# EAGLE design Lipmouse_Daughterboard (EAGLE 6.5.0)
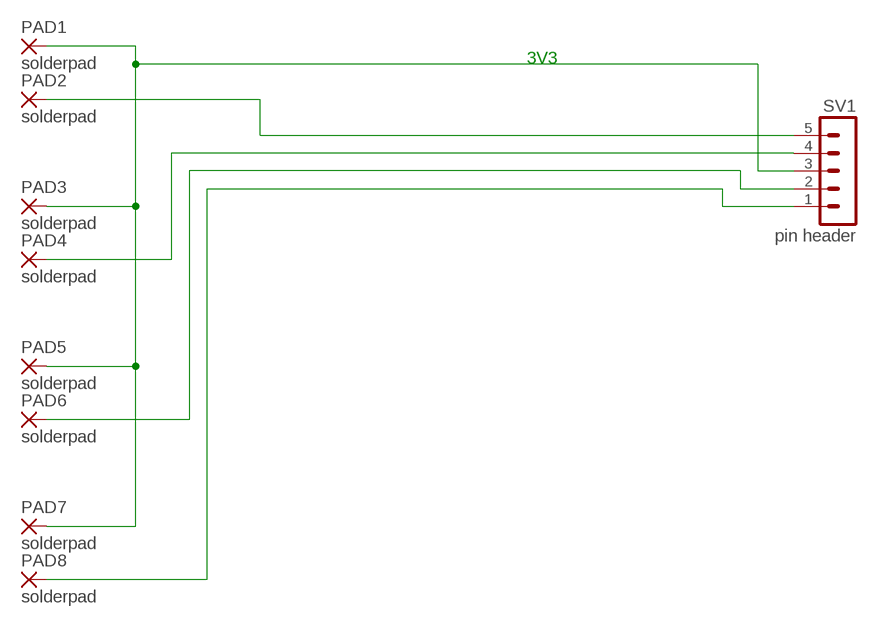
[diagram p0: schematic, sheet 1]

## Parts
PAD1  solderpad  SMD5  [SMD2,54-5,08]
PAD2  solderpad  SMD5  [SMD2,54-5,08]
PAD3  solderpad  SMD5  [SMD2,54-5,08]
PAD4  solderpad  SMD5  [SMD2,54-5,08]
PAD5  solderpad  SMD5  [SMD2,54-5,08]
PAD6  solderpad  SMD5  [SMD2,54-5,08]
PAD7  solderpad  SMD5  [SMD2,54-5,08]
PAD8  solderpad  SMD5  [SMD2,54-5,08]
SV1  pin header  MA05-1  [MA05-1]

## Nets
3V3: PAD1.1(P) PAD3.1(P) PAD5.1(P) PAD7.1(P) SV1.3
N$20: PAD2.1(P) SV1.5
N$21: PAD4.1(P) SV1.4
N$22: PAD6.1(P) SV1.2
N$23: PAD8.1(P) SV1.1

## Notes on the sheet
- 3V3

## Library data of the parts
PAD1-PAD8 = wirepad:SMD5: SMD PAD
SV1 = con-lstb:MA05-1: PIN HEADER; OC_FARNELL: unknown; OC_NEWARK: unknown

## Board
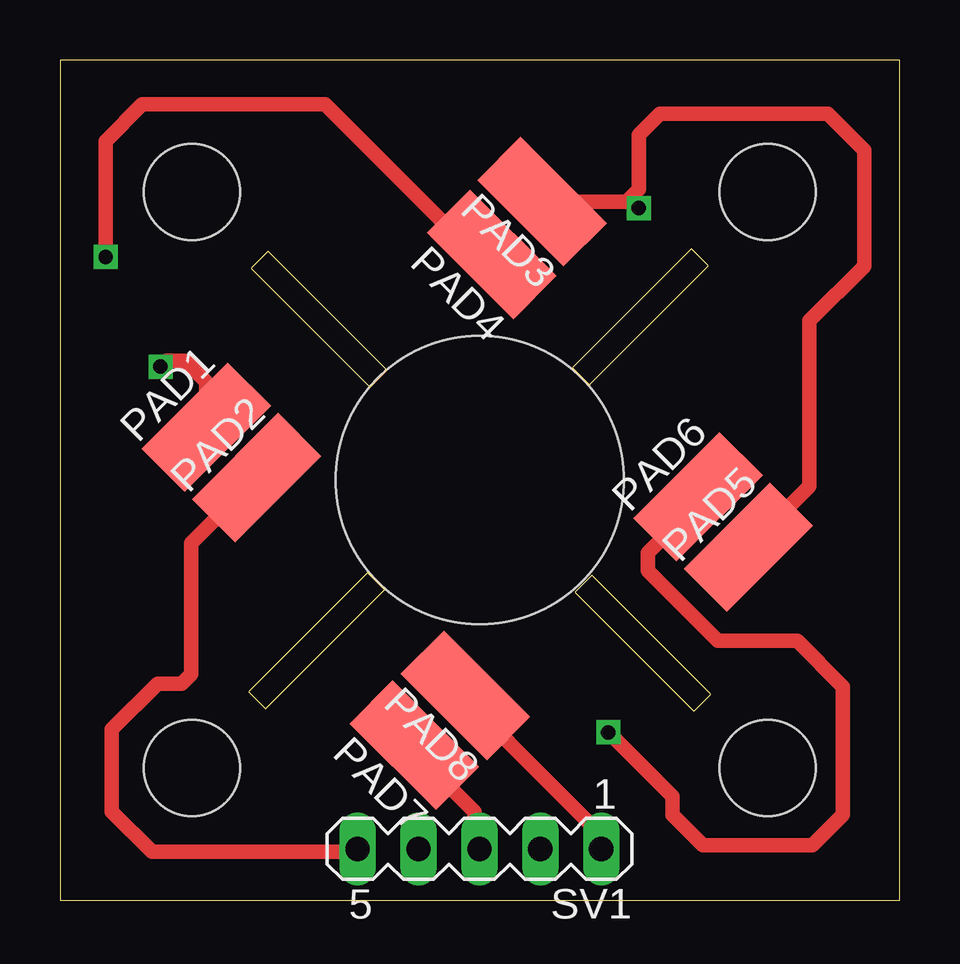
[diagram p1: board, top side]
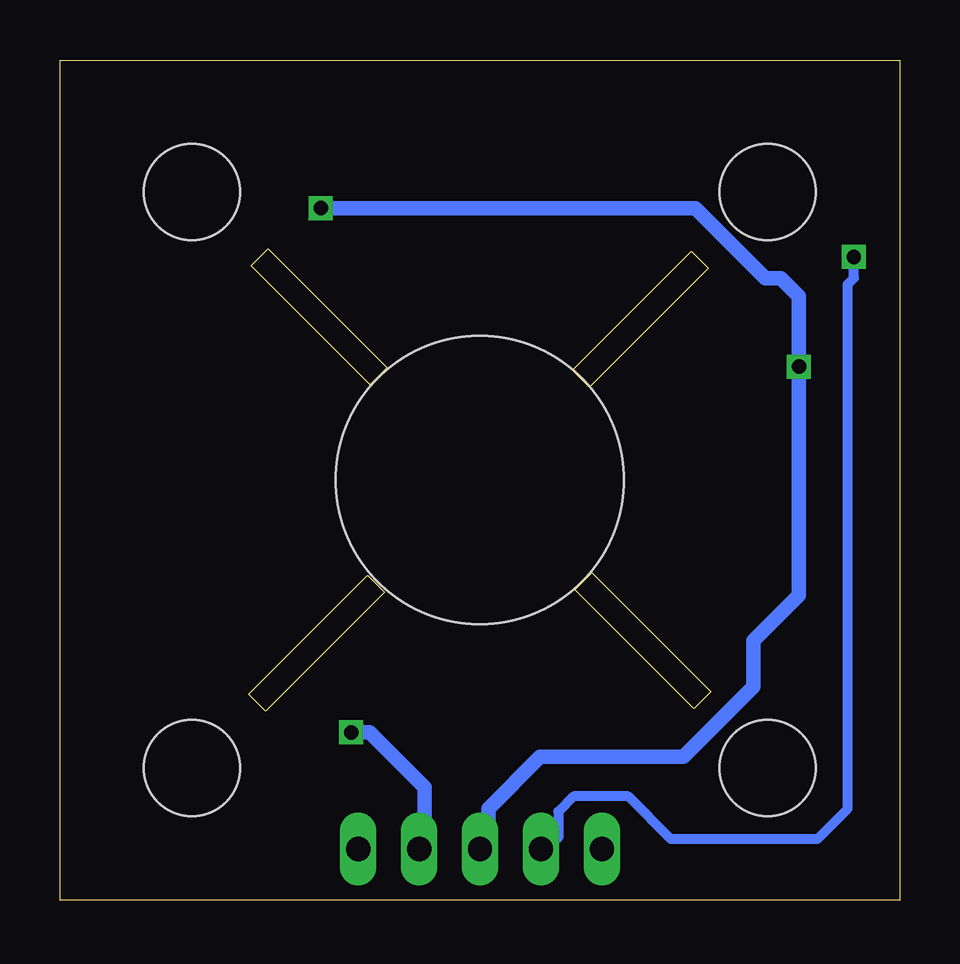
[diagram p2: board, bottom side, seen from below]

Size 35 x 35 mm. Coordinates in mm from the lower left corner, seen from the top.
Outline: 0,0 35,0 35,35 0,35 0,0
Copper layers (1*16): Top 0.035mm / dielectric 1.5mm / Bottom 0.035mm
Design rules "default *": minimum track width 10mil, minimum drill 0.6mm, track to track 8mil, track to pad 8mil, pad to pad 8mil, via to via 8mil, smd to smd 8mil, copper to edge 10mil, drill to drill 8mil, minimum pad ring 10mil, minimum via ring 8mil, stop-mask expansion 4mil, vias tented up to drill 0mil, thermal gap 10mil
Holes 4 mm at 5.5,29.5 29.5,29.5 5.5,5.5 29.5,5.5
Holes 12 mm at 17.5,17.5

### Footprints (pad centres in the part's own frame; a part is rotated, then mirrored left to right if it is on the bottom)
SMD2,54-5,08 = smd 2.54 x 5.08: 1 0,0
MA05-1 = drill 1.016 long: 1 -5.08,0; 2 -2.54,0; 3 0,0; 4 2.54,0; 5 5.08,0

### Placement (x,y rotation side)
PAD1  6.1,19.7 315 top
PAD2  8.2,17.6 315 top
PAD3  20.1,29.1 45 top
PAD4  18,26.9 45 top
PAD5  28.7,14.7 315 top
PAD6  26.6,16.8 315 top
PAD7  14.77,6.45 45 top
PAD8  16.9,8.53 45 top
SV1  17.49,2.13 180 top

### Tracks (layer width: path | path; a pad name or v marks a point on that pad's centre or on a via)
3V3  (via drill 0.6)
  Top 0.61: 14.5,5.93 PAD7.1 14.77,6.01 14.48,5.71 15.24,5.71 17.27,3.68 17.27,2.09 SV1.3 | PAD3.1 23.62,29.1 | 23.62,29.1 23.86,29.1 v24.13,28.83 | PAD5.1 31.24,17.24 31.24,24.13 33.53,26.42 33.53,31.24 32,32.77 25.02,32.77 24.13,31.88 24.13,29.61 23.62,29.1 | PAD1.1 6.1,21.59 5.21,22.48 4.45,22.48 v4.19,22.23
  Bottom 0.61: v24.13,28.83 8.51,28.83 5.59,25.91 4.95,25.91 4.19,25.15 v4.19,22.23 4.19,12.7 6.1,10.79 6.1,8.89 9.02,5.97 14.99,5.97 17.14,3.81 17.14,2.22 SV1.3
N$20
  Top 0.61: PAD2.1 5.46,14.86 5.46,9.4 5.08,9.02 4.06,9.02 2.16,7.11 2.16,3.68 3.84,2 12.15,2 SV1.5
N$21  (via drill 0.6)
  Top 0.61: PAD4.1 17.3,26.9 11.05,33.15 3.43,33.15 1.91,31.62 v1.91,26.8
  Bottom 0.406: SV1.4 14.22,2.6 14.22,3.68 13.59,4.32 11.3,4.32 9.53,2.54 3.43,2.54 2.16,3.81 2.16,25.65 1.91,25.91 v1.91,26.8
N$22  (via drill 0.6)
  Top 0.61: PAD6.1 26.6,16.57 24.51,14.48 24.51,13.72 27.43,10.79 30.73,10.79 32.64,8.89 32.64,3.56 31.37,2.29 26.8,2.29 25.53,3.56 25.53,4.32 v22.86,6.99
  Bottom 0.61: v22.86,6.99 22.1,6.99 19.81,4.7 19.81,2.09 SV1.2
N$23
  Top 0.61: 18.72,6.58 PAD8.1 16.9,8.37 22.23,3.05 22.23,2.22 SV1.1